# EAGLE design mobo-dbus-combined (EAGLE 6.6.0)
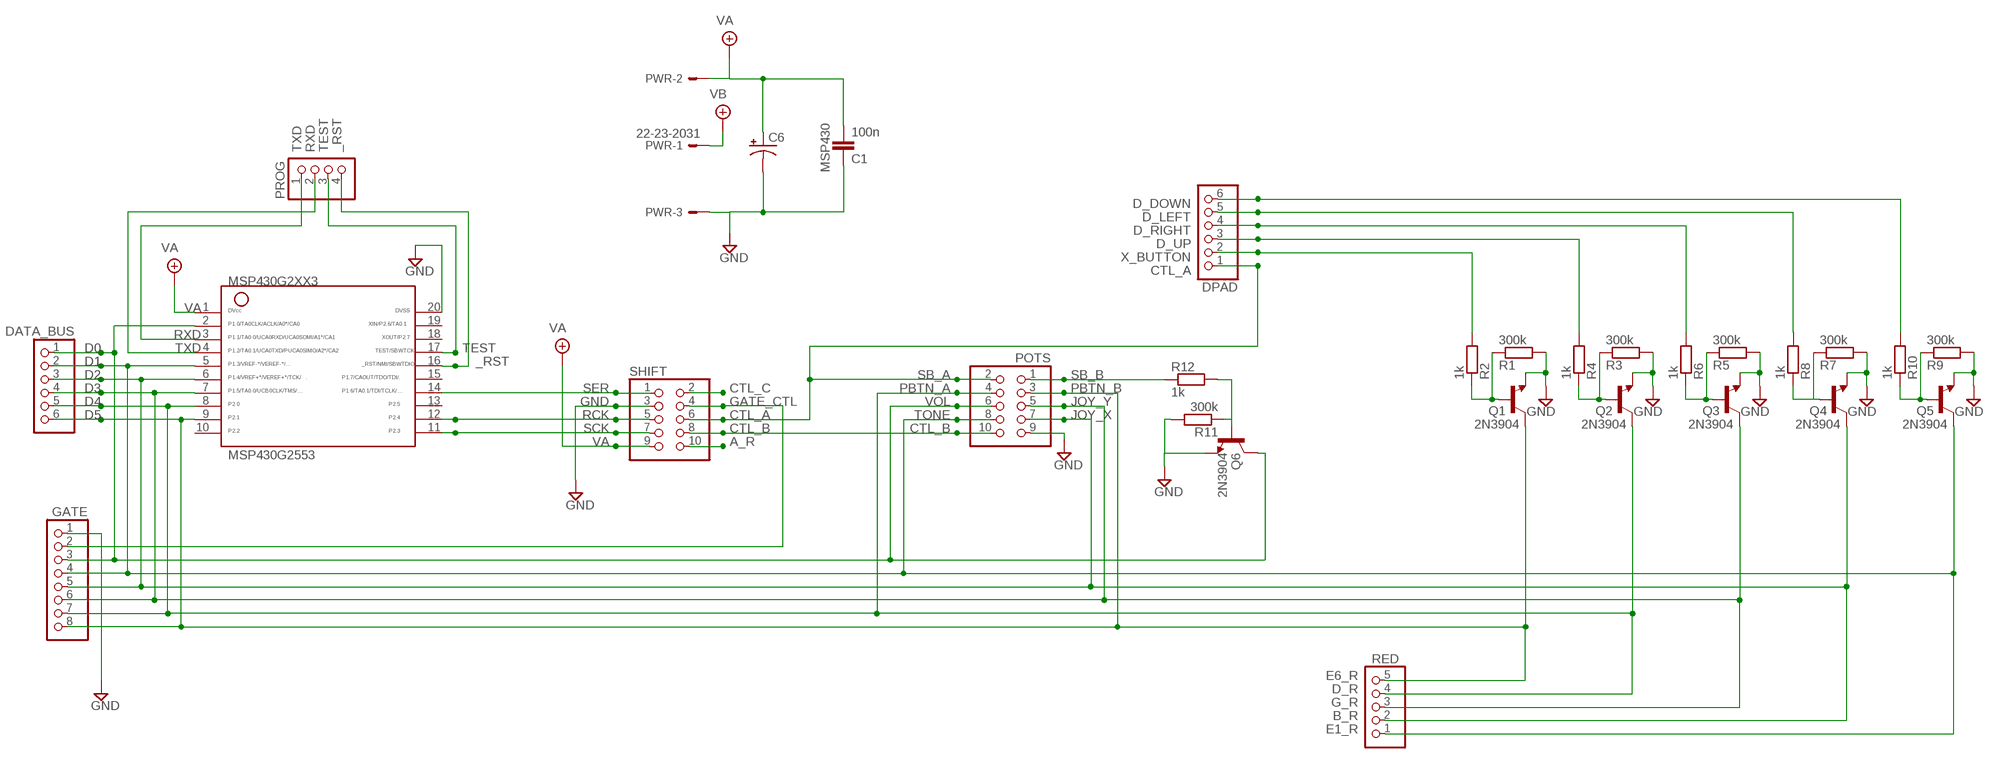
[diagram p0: schematic, sheet 1]

## Parts
C1  100n  050X030_050  [050X030_050_3]
C6  0501  [050_020_1]
DATA_BUS  PINHD-1X6  [1X06]
DPAD  PINHD-1X6  [1X06]
GATE  PINHD-1X8  [1X08]
MSP430G2553  G2XX3---N20  [N20]
POTS  PINHD-2X5  [2X05]
PROG  PINHD-1X4  [1X04]
PWR  22-23-2031  [22-23-2031]
Q1  2N3904  [TO92-]
Q2  2N3904  [TO92-]
Q3  2N3904  [TO92-]
Q4  2N3904  [TO92-]
Q5  2N3904  [TO92-]
Q6  2N3904  [TO92-]
R1  300k  6MM-EU1  [R0207/1V]
R2  1k  6MM-EU1  [R0207/1V]
R3  300k  6MM-EU1  [R0207/1V]
R4  1k  6MM-EU1  [R0207/1V]
R5  300k  6MM-EU1  [R0207/1V]
R6  1k  6MM-EU1  [R0207/1V]
R7  300k  6MM-EU1  [R0207/1V]
R8  1k  6MM-EU1  [R0207/1V]
R9  300k  6MM-EU1  [R0207/1V]
R10  1k  6MM-EU1  [R0207/1V]
R11  300k  6MM-EU1  [R0207/1V]
R12  1k  6MM-EU1  [R0207/1V]
RED  PINHD-1X5  [1X05]
SHIFT  PINHD-2X5  [2X05]

## Nets
_RST: MSP430G2553.16 PROG.4
CTL_A: DPAD.1 POTS.2 SHIFT.6
CTL_B: POTS.10 SHIFT.8
CTL_C: SHIFT.2
D0: DATA_BUS.1 GATE.3 MSP430G2553.2 POTS.6 Q6.1(C) SHIFT.10
D1: DATA_BUS.2 GATE.4 MSP430G2553.5 POTS.8 Q5.1(C) RED.1
D2: DATA_BUS.3 GATE.5 MSP430G2553.6 POTS.7 Q4.1(C) RED.2
D3: DATA_BUS.4 GATE.6 MSP430G2553.7 POTS.5 Q3.1(C) RED.3
D4: DATA_BUS.5 GATE.7 MSP430G2553.8 POTS.4 Q2.1(C) RED.4
D5: DATA_BUS.6 GATE.8 MSP430G2553.9 POTS.3 Q1.1(C) RED.5
D_DOWN: DPAD.6 R10.2
D_LEFT: DPAD.5 R8.2
D_RIGHT: DPAD.4 R6.2
D_UP: DPAD.3 R4.2
GATE_CTL: GATE.2 SHIFT.4
GND: C1.1 C6.- GATE.1 MSP430G2553.20 POTS.9 PWR.3 Q1.3(E) Q2.3(E) Q3.3(E) Q4.3(E) Q5.3(E) Q6.3(E) R1.2 R3.2 R5.2 R7.2 R9.2 R11.2 SHIFT.3
N$1: Q6.2(B) R11.1 R12.2
N$13: Q1.2(B) R1.1 R2.1
N$14: Q2.2(B) R3.1 R4.1
N$15: Q3.2(B) R5.1 R6.1
N$16: Q4.2(B) R7.1 R8.1
N$17: Q5.2(B) R9.1 R10.1
N$27: POTS.1 R12.1
RCK: MSP430G2553.12 SHIFT.5
RXD: MSP430G2553.3 PROG.1
SCK: MSP430G2553.11 SHIFT.7
SER: MSP430G2553.14 SHIFT.1
TEST: MSP430G2553.17 PROG.3
TXD: MSP430G2553.4 PROG.2
VA: C1.2 C6.+ MSP430G2553.1 PWR.2 SHIFT.9
VB: PWR.1
X_BUTTON: DPAD.2 R2.2
Unconnected: MSP430G2553.10 MSP430G2553.13 MSP430G2553.15 MSP430G2553.18 MSP430G2553.19

## Notes on the sheet
- MSP430
- CTL_A
- SB_A | SB_B
- PBTN_A | PBTN_B
- VOL | JOY_Y
- TONE | JOY_X
- CTL_B
- A_R
- E6_R
- D_R
- G_R
- B_R
- E1_R

## Library data of the parts
C1 = gm-caps-ceramic:050X030_050: 120 - 150pF Xicon Ceramic Disc 5mm lead spacing
C6 = gm-caps-electro-pol:050: 0.22 - 100uF Xicon values at Mouser.com: 10V: 10 - 100uF; 16V: 2.2 - 47uF; 25V: 0.47 - 47uF; 50V: 0.22 - 22uF
DATA_BUS DPAD = pinhead:PINHD-1X6: PIN HEADER
GATE = pinhead:PINHD-1X8: PIN HEADER
MSP430G2553 = TI_MSP430_v16:G2XX3---N20: MSP430G2XX1 PDIP (N) 20 Pin Package
POTS SHIFT = pinhead:PINHD-2X5: PIN HEADER
PROG = pinhead:PINHD-1X4: PIN HEADER
PWR = jaapie:22-23-2031: .100" (2.54mm) Center Header - 3 Pin; MF: MOLEX; MPN: 22-23-2031; OC_FARNELL: 1462950; OC_NEWARK: 30C0862
Q1-Q6 = gm-trans:2N3904: NPN Transistor
R1-R12 = gm-resistors:6MM-EU: 6mm Resistors (European schematic symbol) Leads spaced 1-6 holes apart for 0.1" perfboard. Suitable for 1/4 watt resistors.
RED = pinhead:PINHD-1X5: PIN HEADER

## Board
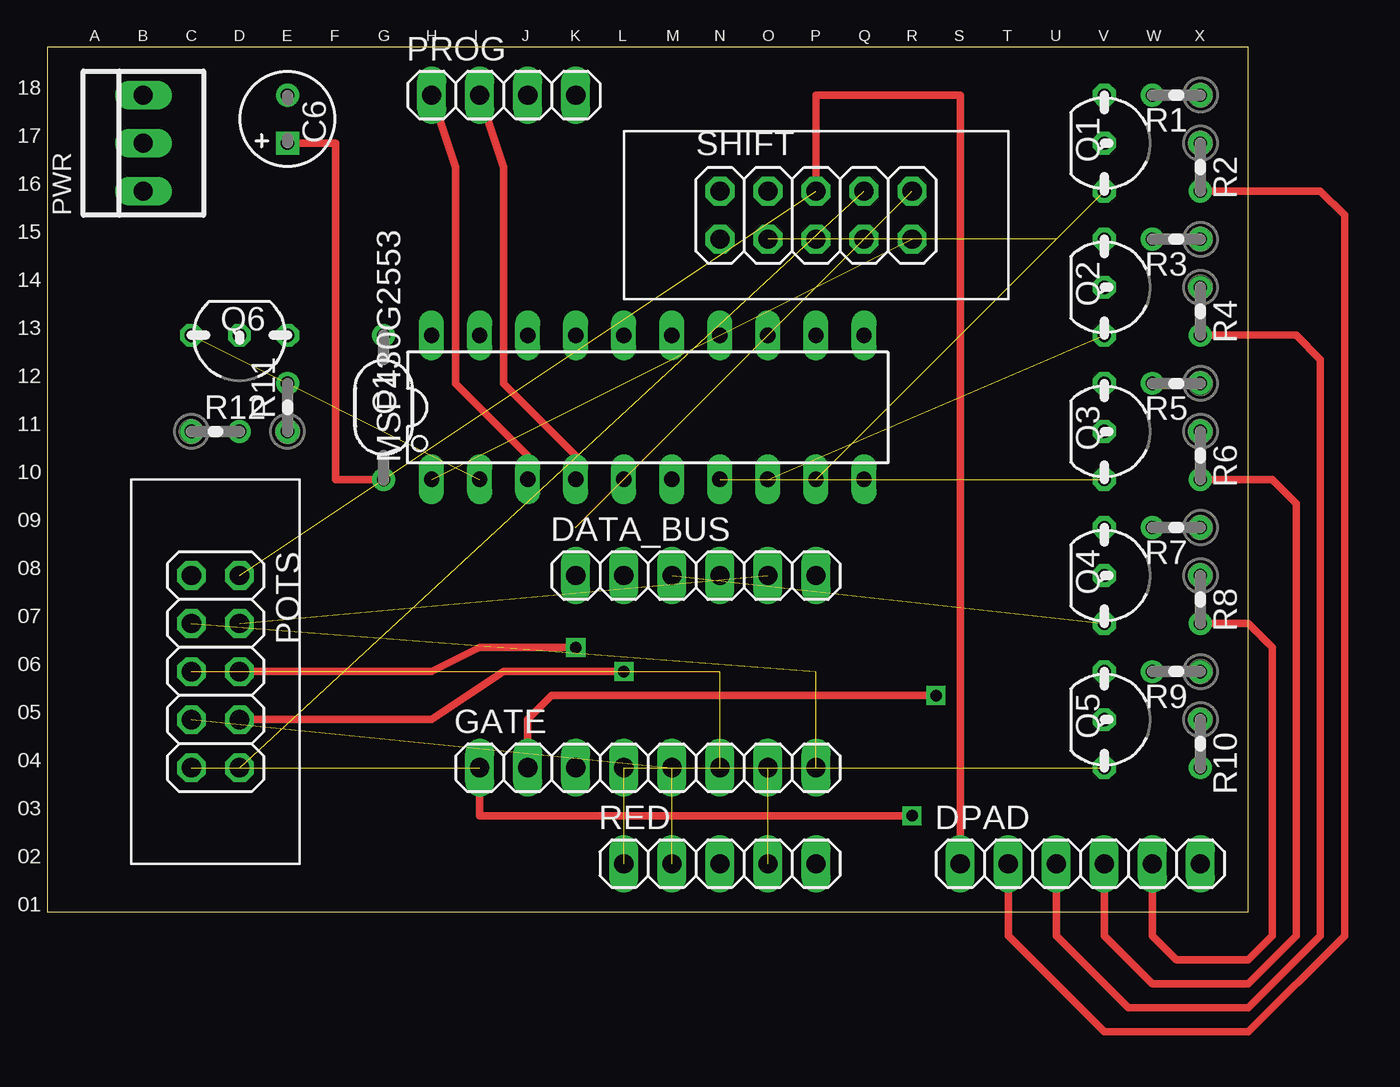
[diagram p1: board, top side]
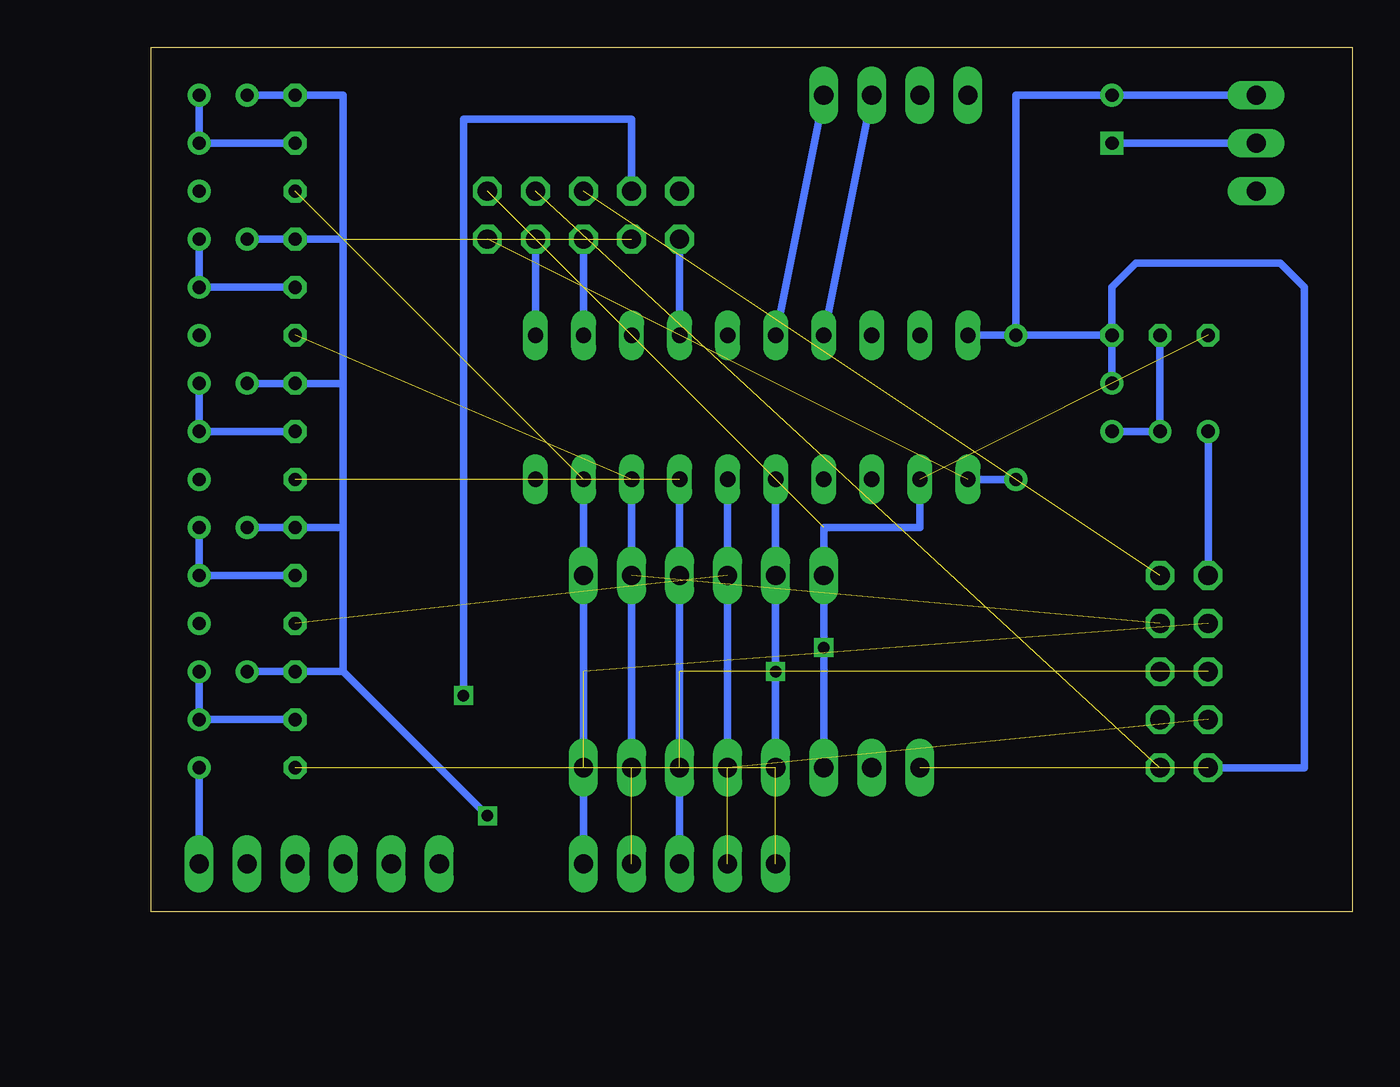
[diagram p2: board, bottom side, seen from below]

Size 63.49 x 45.71 mm. Coordinates in mm from the lower left corner, seen from the top.
Outline: 0,0 63.49,0 63.49,45.71 0,45.71 0,0
Copper layers (1*16): Top 0.035mm / dielectric 1.5mm / Bottom 0.035mm
Design rules "default": minimum track width 10mil, minimum drill 24mil, track to track 8mil, track to pad 8mil, pad to pad 8mil, via to via 8mil, smd to smd 8mil, copper to edge 40mil, drill to drill 8mil, minimum pad ring 10mil, minimum via ring 8mil, stop-mask expansion 4mil, vias tented up to drill 0mil, thermal gap 10mil

### Footprints (pad centres in the part's own frame; a part is rotated, then mirrored left to right if it is on the bottom)
050X030_050_3 = drill 0.7: 1 -3.81,0; 2 3.81,0
050_020_1 = drill 0.7 square: + -1.27,0 | drill 0.7: - 1.27,0
1X06 = drill 1.016 long: 1 -6.35,0; 2 -3.81,0; 3 -1.27,0; 4 1.27,0; 5 3.81,0; 6 6.35,0
1X08 = drill 1.016 long: 1 -8.89,0; 2 -6.35,0; 3 -3.81,0; 4 -1.27,0; 5 1.27,0; 6 3.81,0; 7 6.35,0; 8 8.89,0
N20 = drill 0.813 long: 1 -11.435,-3.81; 2 -8.895,-3.81; 3 -6.355,-3.81; 4 -3.815,-3.81; 5 -1.275,-3.81; 6 1.265,-3.81; 7 3.805,-3.81; 8 6.345,-3.81; 9 8.885,-3.81; 10 11.425,-3.81; 11 11.425,3.81; 12 8.885,3.81; 13 6.345,3.81; 14 3.805,3.81; 15 1.265,3.81; 16 -1.275,3.81; 17 -3.815,3.81; 18 -6.355,3.81; 19 -8.895,3.81; 20 -11.435,3.81
2X05 = drill 1.016 octagon: 1 -5.08,-1.27; 2 -5.08,1.27; 3 -2.54,-1.27; 4 -2.54,1.27; 5 0,-1.27; 6 0,1.27; 7 2.54,-1.27; 8 2.54,1.27; 9 5.08,-1.27; 10 5.08,1.27
1X04 = drill 1.016 long: 1 -3.81,0; 2 -1.27,0; 3 1.27,0; 4 3.81,0
22-23-2031 = drill 1 long: 1 -2.54,0; 2 0,0; 3 2.54,0
TO92- = drill 0.7 octagon: 1 2.54,0; 2 0,0; 3 -2.54,0
R0207/1V = drill 0.7: 1 -1.27,0; 2 1.27,0
1X05 = drill 1.016 long: 1 -5.08,0; 2 -2.54,0; 3 0,0; 4 2.54,0; 5 5.08,0

### Placement (x,y rotation side)
C1  17.78,26.67 270 top
C6  12.7,41.91 90 top
DATA_BUS  34.29,17.78 0 top
DPAD  54.61,2.54 0 top
GATE  31.75,7.62 0 top
MSP430G2553  31.75,26.67 0 top
POTS  8.89,12.7 270 top
PROG  24.13,43.18 0 top
PWR  5.08,40.64 90 top
Q1  55.88,40.64 270 top
Q2  55.88,33.02 270 top
Q3  55.88,25.4 270 top
Q4  55.88,17.78 270 top
Q5  55.88,10.16 270 top
Q6  10.16,30.48 180 top
R1  59.69,43.18 180 top
R2  60.96,39.37 270 top
R3  59.69,35.56 180 top
R4  60.96,31.75 270 top
R5  59.69,27.94 180 top
R6  60.96,24.13 270 top
R7  59.69,20.32 180 top
R8  60.96,16.51 270 top
R9  59.69,12.7 180 top
R10  60.96,8.89 270 top
R11  12.7,26.67 90 top
R12  8.89,25.4 0 top
RED  35.56,2.54 0 top
SHIFT  40.64,36.83 0 top

### Tracks (layer width: path | path; a pad name or v marks a point on that pad's centre or on a via)
_RST
  Bottom 0.406: PROG.4 MSP430G2553.16
CTL_A  (1 unrouted)
  Top 0.406: SHIFT.6 40.64,43.18 48.26,43.18 DPAD.1
CTL_B  (1 unrouted)
D0  (via drill 0.6)  (2 unrouted)
  Top 0.406: POTS.6 20.32,12.7 22.86,13.97 v27.94,13.97
  Bottom 0.406: MSP430G2553.2 22.86,20.32 27.94,20.32 DATA_BUS.1 v27.94,13.97 GATE.3
D1  (via drill 0.6)  (2 unrouted)
  Top 0.406: POTS.8 20.32,10.16 24.13,12.7 v30.48,12.7
  Bottom 0.406: MSP430G2553.5 DATA_BUS.2 v30.48,12.7 GATE.4
D2  (3 unrouted)
  Bottom 0.406: MSP430G2553.6 DATA_BUS.3 GATE.5
D3  (3 unrouted)
  Bottom 0.406: RED.3 DATA_BUS.4 35.55,12.7 MSP430G2553.7
D4  (3 unrouted)
  Bottom 0.406: MSP430G2553.8 DATA_BUS.5 GATE.7
D5  (3 unrouted)
  Bottom 0.406: RED.5 DATA_BUS.6 40.63,12.7 MSP430G2553.9
D_DOWN
  Bottom 0.406: DPAD.6 R10.2
D_LEFT
  Top 0.406: DPAD.5 58.42,-1.27 59.69,-2.54 63.5,-2.54 64.77,-1.27 64.77,13.97 63.5,15.24 R8.2
D_RIGHT
  Top 0.406: R6.2 64.77,22.86 66.04,21.59 66.04,-1.27 63.5,-3.81 58.42,-3.81 55.88,-1.27 DPAD.4
D_UP
  Top 0.406: DPAD.3 53.34,-1.27 57.15,-5.08 63.5,-5.08 67.31,-1.27 67.31,29.21 66.04,30.48 R4.2
GATE_CTL  (via drill 0.6)
  Top 0.406: v46.99,11.43 26.67,11.43 25.4,10.16 GATE.2
  Bottom 0.406: SHIFT.4 38.1,41.91 46.99,41.91 v46.99,11.43
GND  (via drill 0.6)  (2 unrouted)
  Top 0.406: GATE.1 22.86,5.08 v45.72,5.08
  Bottom 0.406: R3.2 Q2.3 53.34,35.56 | R5.2 Q3.3 53.34,27.94 | R7.2 Q4.3 53.34,20.32 | Q6.3 R11.2 | R9.2 Q5.3 53.34,12.7 | 53.34,12.7 53.34,20.32 | R1.2 Q1.3 53.34,43.18 53.34,35.56 | 53.34,35.56 53.34,27.94 | 53.34,27.94 53.34,20.32 | PWR.3 C6.- 17.78,43.18 C1.1 | C1.1 MSP430G2553.20 | Q6.3 C1.1 | v45.72,5.08 53.34,12.7 | POTS.9 2.54,7.62 2.54,33.02 3.81,34.29 11.43,34.29 12.7,33.02 Q6.3
N$1
  Bottom 0.406: R11.1 R12.2 Q6.2
N$13
  Bottom 0.406: R1.1 R2.1 Q1.2
N$14
  Bottom 0.406: Q2.2 R4.1 R3.1
N$15
  Bottom 0.406: Q3.2 R6.1 R5.1
N$16
  Bottom 0.406: Q4.2 R8.1 R7.1
N$17
  Bottom 0.406: Q5.2 R10.1 R9.1
N$27
  Bottom 0.406: R12.1 POTS.1
RCK
  Bottom 0.406: MSP430G2553.12 SHIFT.5
RXD
  Top 0.406: PROG.1 21.59,39.37 21.59,27.94 25.4,24.13 MSP430G2553.3
SCK
  Bottom 0.406: MSP430G2553.11 SHIFT.7
SER
  Bottom 0.406: MSP430G2553.14 SHIFT.1
TEST
  Bottom 0.406: MSP430G2553.17 PROG.3
TXD
  Top 0.406: PROG.2 24.13,39.37 24.13,27.94 27.94,24.13 MSP430G2553.4
VA  (1 unrouted)
  Top 0.406: C6.+ 15.24,40.64 15.24,22.86 C1.2
  Bottom 0.406: PWR.2 C6.+ | C1.2 MSP430G2553.1
X_BUTTON
  Top 0.406: R2.2 67.31,38.1 68.58,36.83 68.58,-1.27 63.5,-6.35 55.88,-6.35 50.8,-1.27 DPAD.2

### Text on the board
tNames: A | B | C | D | E | F | G | H | I | J | K | L | M | N | O | P | Q | R | S | T | U | V | W | X | 18 | 17 | 16 | 15 | 14 | 13 | 12 | 11 | 10 | 09 | 08 | 07 | 06 | 05 | 04 | 03 | 02 | 01